# Altium schematic sheet Cyusb3314_Indicator.SchDoc
size 391 x 287 mm
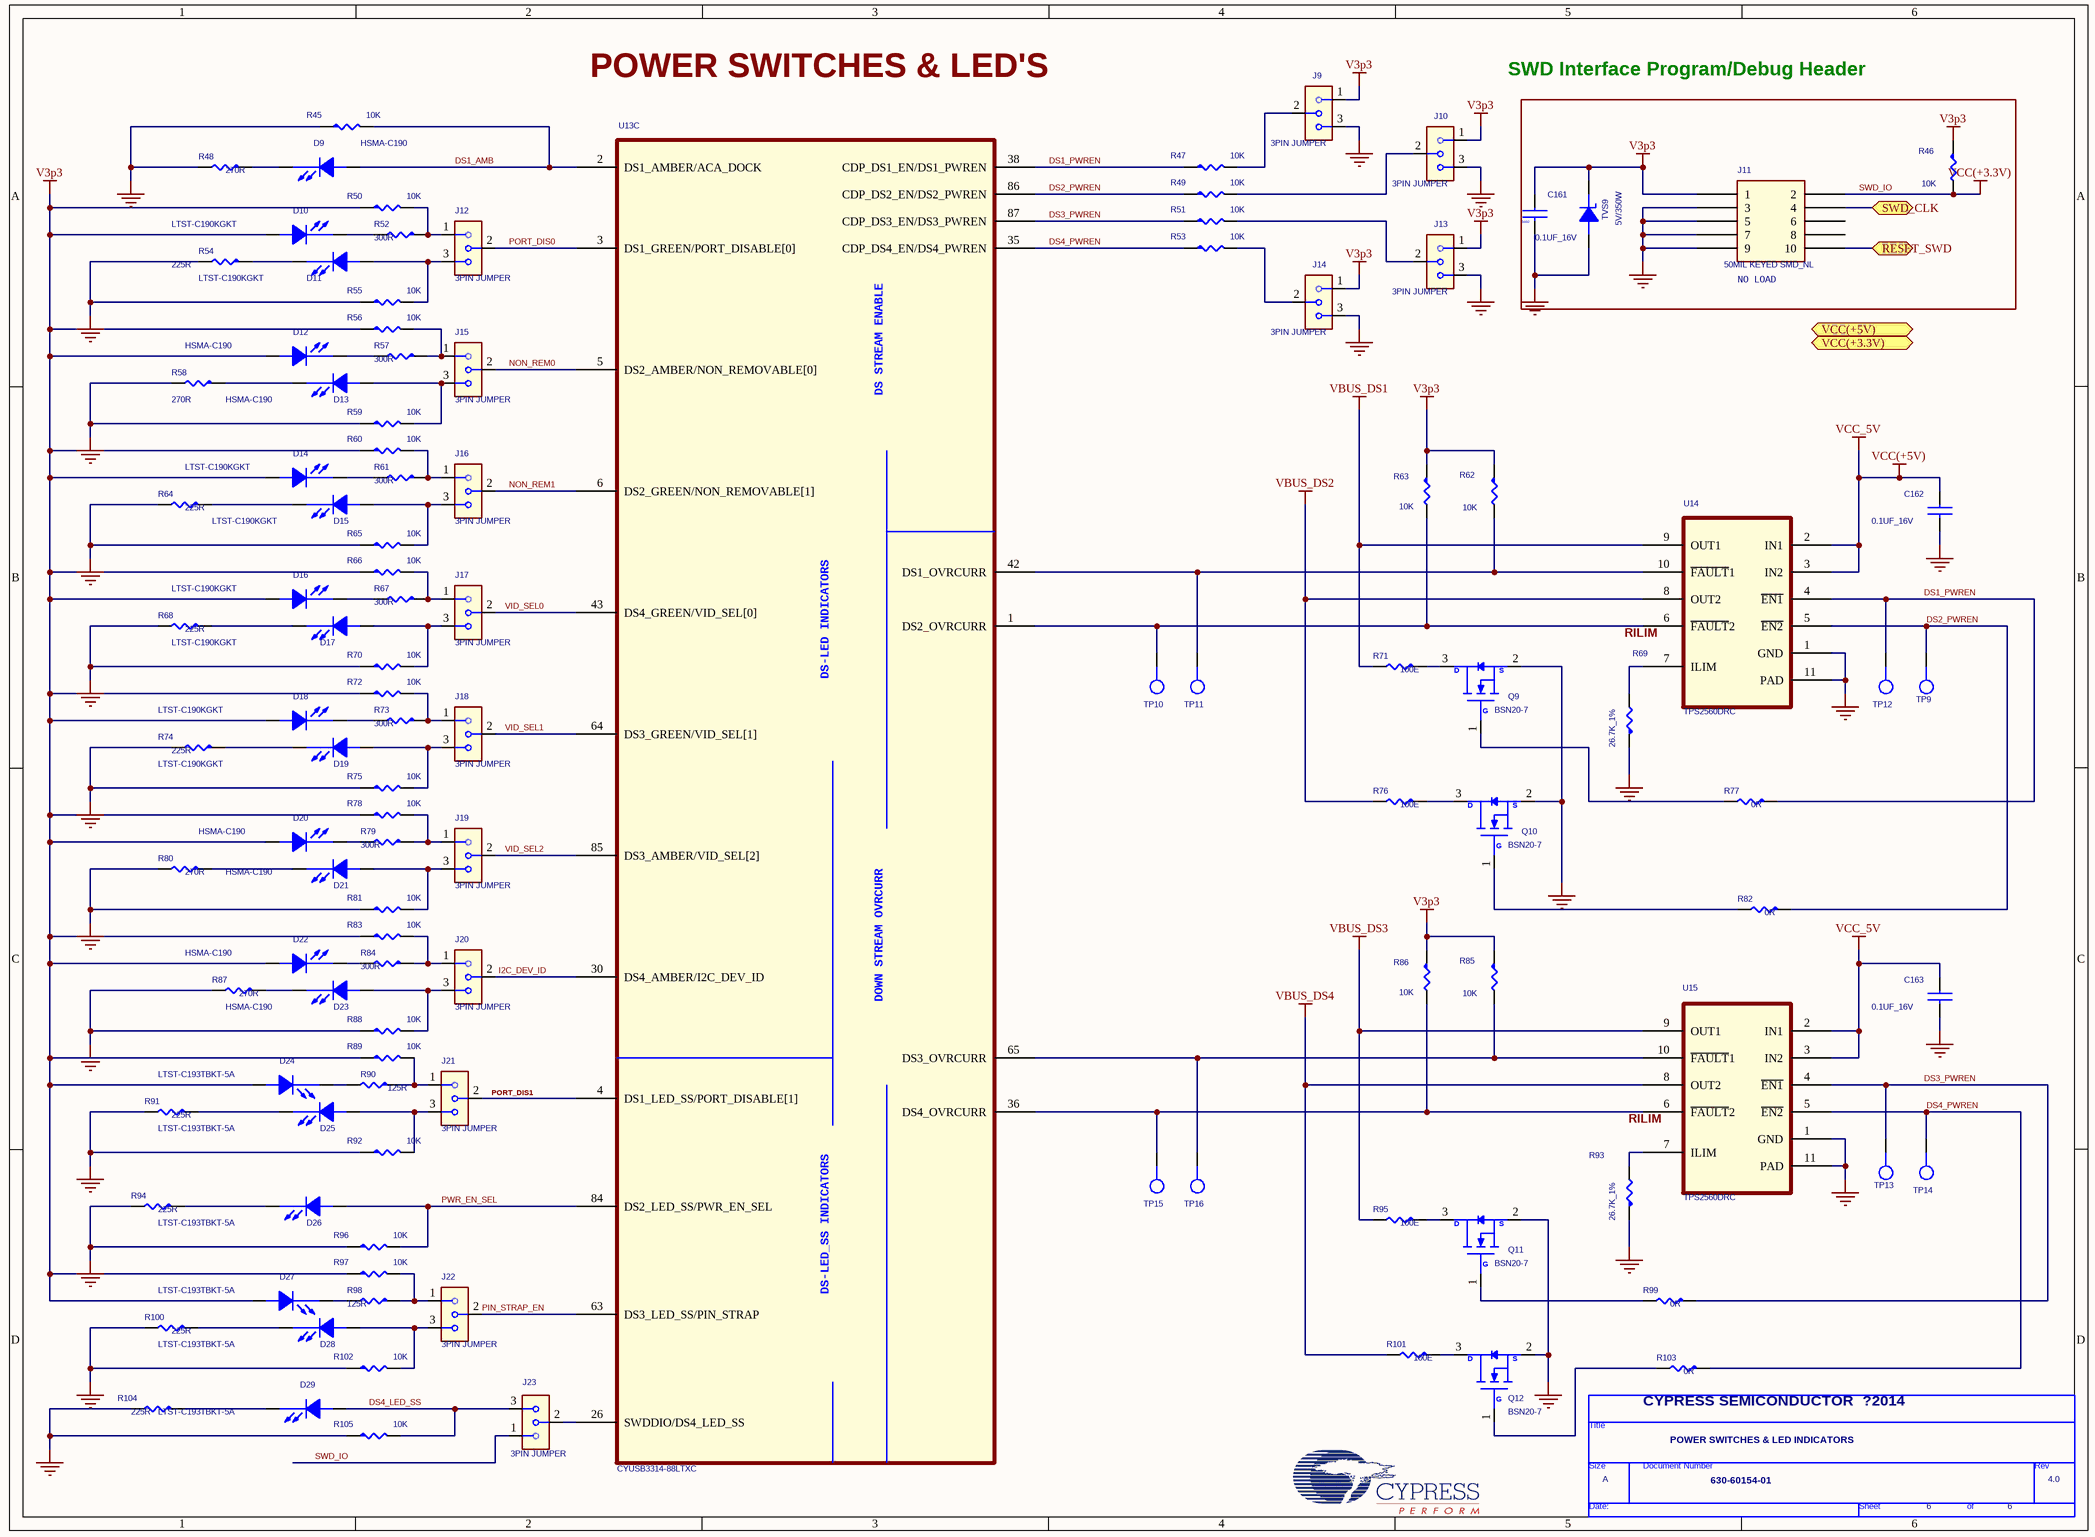
[diagram p0: Cyusb3314_Indicator.SchDoc]

## Parts
*  Page Count: 6  Page Size: A  Title: POWER SWITCHES & LED INDICATORS  RevCode: 4.0  Doc: 630-60154-01  (hidden comment: TitleBlock0)  (graphical)
C161  0.1UF_16V  [CAPC1005X55M]
C162  0.1UF_16V  [CAPC1005X56M]
C163  0.1UF_16V  [CAPC1005X56M]
D9  HSMA-C190  [LEDC1608X80M]
D10  LTST-C190KGKT  [LEDC1608X80M]
D11  LTST-C190KGKT  [LEDC1608X80M]
D12  HSMA-C190  [LEDC1608X80M]
D13  HSMA-C190  [LEDC1608X80M]
D14  LTST-C190KGKT  [LEDC1608X80M]
D15  LTST-C190KGKT  [LEDC1608X80M]
D16  LTST-C190KGKT  [LEDC1608X80M]
D17  LTST-C190KGKT  [LEDC1608X80M]
D18  LTST-C190KGKT  [LEDC1608X80M]
D19  LTST-C190KGKT  [LEDC1608X80M]
D20  HSMA-C190  [LEDC1608X80M]
D21  HSMA-C190  [LEDC1608X80M]
D22  HSMA-C190  [LEDC1608X80M]
D23  HSMA-C190  [LEDC1608X80M]
D24  LTST-C193TBKT-5A  [LEDC1608X35M]
D25  LTST-C193TBKT-5A  [LEDC1608X35M]
D26  LTST-C193TBKT-5A  [LEDC1608X35M]
D27  LTST-C193TBKT-5A  [LEDC1608X35M]
D28  LTST-C193TBKT-5A  [LEDC1608X35M]
D29  LTST-C193TBKT-5A  [LEDC1608X35M]
J9  3PIN JUMPER  [TE_3-644456-3]
J10  3PIN JUMPER  [TE_3-644456-3]
J11  50MIL KEYED SMD_NL  [SAMTEC_FTSH-105-01-L-DV-K]
J12  3PIN JUMPER  [TE_3-644456-3]
J13  3PIN JUMPER  [TE_3-644456-3]
J14  3PIN JUMPER  [TE_3-644456-3]
J15  3PIN JUMPER  [TE_3-644456-3]
J16  3PIN JUMPER  [TE_3-644456-3]
J17  3PIN JUMPER  [TE_3-644456-3]
J18  3PIN JUMPER  [TE_3-644456-3]
J19  3PIN JUMPER  [TE_3-644456-3]
J20  3PIN JUMPER  [TE_3-644456-3]
J21  3PIN JUMPER  [TE_3-644456-3]
J22  3PIN JUMPER  [TE_3-644456-3]
J23  3PIN JUMPER  [TE_3-644456-3]
Q9  BSN20-7  [SOT92P240X110-3M]
Q10  BSN20-7  [SOT92P240X110-3M]
Q11  BSN20-7  [SOT92P240X110-3M]
Q12  BSN20-7  [SOT92P240X110-3M]
R45  10K  [RESC1005X40M]
R46  10K  [RESC1005X40M]
R47  10K  [RESC1005X40M]
R48  270R  [RESC1608X50M]
R49  10K  [RESC1005X40M]
R50  10K  [RESC1005X40M]
R51  10K  [RESC1005X40M]
R52  300R  [RESC2012X65M]
R53  10K  [RESC1005X40M]
R54  225R  [RESC1608X50M]
R55  10K  [RESC1005X40M]
R56  10K  [RESC1005X40M]
R57  300R  [RESC2012X65M]
R58  270R  [RESC1608X50M]
R59  10K  [RESC1005X40M]
R60  10K  [RESC1005X40M]
R61  300R  [RESC2012X65M]
R62  10K  [RESC1005X40M]
R63  10K  [RESC1005X40M]
R64  225R  [RESC1608X50M]
R65  10K  [RESC1005X40M]
R66  10K  [RESC1005X40M]
R67  300R  [RESC2012X65M]
R68  225R  [RESC1608X50M]
R69  26.7K_1%  [RESC1005X40M]
R70  10K  [RESC1005X40M]
R71  100E  [RESC1608X50M]
R72  10K  [RESC1005X40M]
R73  300R  [RESC2012X65M]
R74  225R  [RESC1608X50M]
R75  10K  [RESC1005X40M]
R76  100E  [RESC1608X50M]
R77  0R  [RESC1608X50M]
R78  10K  [RESC1005X40M]
R79  300R  [RESC2012X65M]
R80  270R  [RESC1608X50M]
R81  10K  [RESC1005X40M]
R82  0R  [RESC1608X50M]
R83  10K  [RESC1005X40M]
R84  300R  [RESC2012X65M]
R85  10K  [RESC1005X40M]
R86  10K  [RESC1005X40M]
R87  270R  [RESC1608X50M]
R88  10K  [RESC1005X40M]
R89  10K  [RESC1005X40M]
R90  125R  [RESC2012X65M]
R91  225R  [RESC1608X50M]
R92  10K  [RESC1005X40M]
R93  26.7K_1%  [RESC1005X40M]
R94  225R  [RESC1608X50M]
R95  100E  [RESC1608X50M]
R96  10K  [RESC1005X40M]
R97  10K  [RESC1005X40M]
R98  125R  [RESC2012X65M]
R99  0R  [RESC1608X50M]
R100  225R  [RESC1608X50M]
R101  100E  [RESC1608X50M]
R102  10K  [RESC1005X40M]
R103  0R  [RESC1608X50M]
R104  225R  [RESC1608X50M]
R105  10K  [RESC1005X40M]
TP9  TP_YEL  [KEYSTONE_5000]  (value not drawn)
TP10  TEST POINT  [TP25C50]  (value not drawn)
TP11  TP_YEL  [KEYSTONE_5000]  (value not drawn)
TP12  TEST POINT  [TP25C50]  (value not drawn)
TP13  TP_YEL  [KEYSTONE_5000]  (value not drawn)
TP14  TEST POINT  [TP25C50]  (value not drawn)
TP15  TEST POINT  [TP25C50]  (value not drawn)
TP16  TP_YEL  [KEYSTONE_5000]  (value not drawn)
TVS9  5V/350W  [SOD2513X120M]
U13  CYUSB3314-88LTXC  [QFN40P1000X1000X100-89M]  (part C of 3)
U14  TPS2560DRC  [SON50P300X300X100-11M]
U15  TPS2560DRC  [SON50P300X300X100-11M]

## Blocks framed on the sheet
NO LOAD: C161 J11 R46 TVS9

## Ports
RESET_SWD (bidir), SWD_CLK (bidir), VCC(+3.3V) (in), VCC(+5V) (in)

## Nets
GND: C161.2 C162.2 C163.2 J9.3 J10.3 J11.3 J11.5 J11.7 J11.9 J13.3 J14.3 Q9.2(S) Q10.2(S) Q11.2(S) Q12.2(S) R45.1 R48.2 R54.2 R55.1 R58.2 R59.1 R64.2 R65.1 R68.2 R69.1 R70.1 R74.2 R75.1 R80.2 R81.1 R87.2 R88.1 R91.2 R92.1 R93.1 R94.2 R96.1 R100.2 R102.1 R104.2 R105.1 TVS9.2(A) U14.1(GND) U14.11(PAD) U15.1(GND) U15.11(PAD)
SWD_IO: J11.2 J23.1 R46.2  [also labelled VCC(+3.3V)]
V3p3: C161.1 D10.1(ANODE) D12.1(ANODE) D14.1(ANODE) D16.1(ANODE) D18.1(ANODE) D20.1(ANODE) D22.1(ANODE) D24.1(ANODE) D27.1(ANODE) J9.1 J10.1 J11.1 J13.1 J14.1 R46.1 R50.1 R56.1 R60.1 R62.1 R63.1 R66.1 R72.1 R78.1 R83.1 R85.1 R86.1 R89.1 R97.1 TVS9.1(K)
VBUS_DS1: R71.2 U14.9(OUT1)
VBUS_DS2: R76.2 U14.8(OUT2)
VBUS_DS3: R95.2 U15.9(OUT1)
VBUS_DS4: R101.2 U15.8(OUT2)
VCC(+5V): C162.1 C163.1 U14.2(IN1) U14.3(IN2) U15.2(IN1) U15.3(IN2)  [also labelled VCC_5V]
DS1_AMB: D9.1(ANODE) R45.2 U13.2(DS1_AMBER/ACA_DOCK)
DS1_PWREN: R47.1 R77.1 TP12.1(TP) U13.38(CDP_DS1_EN/DS1_PWREN) U14.4(~{EN1})
DS2_PWREN: R49.1 R82.1 TP9.1(TP) U13.86(CDP_DS2_EN/DS2_PWREN) U14.5(~{EN2})
DS3_PWREN: R51.1 R99.1 TP13.1(TP) U13.87(CDP_DS3_EN/DS3_PWREN) U15.4(~{EN1})
DS4_LED_SS: D29.1(ANODE) J23.3 R105.2
DS4_PWREN: R53.1 R103.1 TP14.1(TP) U13.35(CDP_DS4_EN/DS4_PWREN) U15.5(~{EN2})
I2C_DEV_ID: J20.2 U13.30(DS4_AMBER/I2C_DEV_ID)
NON_REM0: J15.2 U13.5(DS2_AMBER/NON_REMOVABLE[0])
NON_REM1: J16.2 U13.6(DS2_GREEN/NON_REMOVABLE[1])
PIN_STRAP_EN: J22.2 U13.63(DS3_LED_SS/PIN_STRAP)
PORT_DIS0: J12.2 U13.3(DS1_GREEN/PORT_DISABLE[0])
PORT_DIS1: J21.2 U13.4(DS1_LED_SS/PORT_DISABLE[1])
PWR_EN_SEL: D26.1(ANODE) R96.2 U13.84(DS2_LED_SS/PWR_EN_SEL)
RESET_SWD: J11.10 ; port RESET_SWD
SWD_CLK: J11.4 ; port SWD_CLK
VID_SEL0: J17.2 U13.43(DS4_GREEN/VID_SEL[0])
VID_SEL1: J18.2 U13.64(DS3_GREEN/VID_SEL[1])
VID_SEL2: J19.2 U13.85(DS3_AMBER/VID_SEL[2])
NetD9_2: D9.2(CATHODE) R48.1
NetD10_2: D10.2(CATHODE) R52.2
NetD11_1: D11.1(ANODE) J12.3 R55.2
NetD11_2: D11.2(CATHODE) R54.1
NetD12_2: D12.2(CATHODE) R57.2
NetD13_1: D13.1(ANODE) J15.3 R59.2
NetD13_2: D13.2(CATHODE) R58.1
NetD14_2: D14.2(CATHODE) R61.2
NetD15_1: D15.1(ANODE) J16.3 R65.2
NetD15_2: D15.2(CATHODE) R64.1
NetD16_2: D16.2(CATHODE) R67.2
NetD17_1: D17.1(ANODE) J17.3 R70.2
NetD17_2: D17.2(CATHODE) R68.1
NetD18_2: D18.2(CATHODE) R73.2
NetD19_1: D19.1(ANODE) J18.3 R75.2
NetD19_2: D19.2(CATHODE) R74.1
NetD20_2: D20.2(CATHODE) R79.2
NetD21_1: D21.1(ANODE) J19.3 R81.2
NetD21_2: D21.2(CATHODE) R80.1
NetD22_2: D22.2(CATHODE) R84.2
NetD23_1: D23.1(ANODE) J20.3 R88.2
NetD23_2: D23.2(CATHODE) R87.1
NetD24_2: D24.2(CATHODE) R90.2
NetD25_1: D25.1(ANODE) J21.3 R92.2
NetD25_2: D25.2(CATHODE) R91.1
NetD26_2: D26.2(CATHODE) R94.1
NetD27_2: D27.2(CATHODE) R98.2
NetD28_1: D28.1(ANODE) J22.3 R102.2
NetD28_2: D28.2(CATHODE) R100.1
NetD29_2: D29.2(CATHODE) R104.1
NetJ9_2: J9.2 R47.2
NetJ10_2: J10.2 R49.2
NetJ12_1: J12.1 R50.2 R52.1
NetJ13_2: J13.2 R51.2
NetJ14_2: J14.2 R53.2
NetJ15_1: J15.1 R56.2 R57.1
NetJ16_1: J16.1 R60.2 R61.1
NetJ17_1: J17.1 R66.2 R67.1
NetJ18_1: J18.1 R72.2 R73.1
NetJ19_1: J19.1 R78.2 R79.1
NetJ20_1: J20.1 R83.2 R84.1
NetJ21_1: J21.1 R89.2 R90.1
NetJ22_1: J22.1 R97.2 R98.1
NetJ23_2: J23.2 U13.26(SWDDIO/DS4_LED_SS)
NetQ9_1: Q9.1(G) R77.2
NetQ9_3: Q9.3(D) R71.1
NetQ10_1: Q10.1(G) R82.2
NetQ10_3: Q10.3(D) R76.1
NetQ11_1: Q11.1(G) R99.2
NetQ11_3: Q11.3(D) R95.1
NetQ12_1: Q12.1(G) R103.2
NetQ12_3: Q12.3(D) R101.1
NetR62_2: R62.2 TP11.1(TP) U13.42(DS1_OVRCURR) U14.10(~{FAULT}1)
NetR63_2: R63.2 TP10.1(TP) U13.1(DS2_OVRCURR) U14.6(~{FAULT}2)
NetR69_2: R69.2 U14.7(ILIM)
NetR85_2: R85.2 TP16.1(TP) U13.65(DS3_OVRCURR) U15.10(~{FAULT}1)
NetR86_2: R86.2 TP15.1(TP) U13.36(DS4_OVRCURR) U15.6(~{FAULT}2)
NetR93_2: R93.2 U15.7(ILIM)

Not connected (* = marked no-connect by the designer): J11 6 8

## Notes on the sheet
- POWER SWITCHES & LED'S
- SWD Interface Program/Debug Header
- (near U14) RILIM
- (near U15) RILIM
- (near R103) CYPRESS SEMICONDUCTOR  ?2014
- (in symbol 0.1 uFd 0402) 0402
- (in symbol CYUSB3314-88LTXC_2, part C) DS STREAM ENABLE; DS-LED INDICATORS; DOWN STREAM OVRCURR; DS-LED_SS INDICATORS
- (in symbol TitleBlock0) Title; Size; Document Number; Rev; Date:; Sheet; of

## Library data of the parts
C161 = 0.1 uFd 0402: CAP .1UF 16V CERAMIC Y5V 0402; Cy_part#: 730R-10010; Manufacturer: Panasonic - ECG; Part Number: ECJ-0EF1C104Z; DEVICE: 0p1uFd_0402; CLASS: DISCRETE; ALT_SYMBOLS: C-CC0402_A; VOLTAGE: 16V; Created by: SNF
C162 C163 = CAPACITOR NON-POL: Manufacturer: *; Part Number: *
D9-D29 = LED: Manufacturer: *
  D9 D12 D13 D20-D23: Part Number: HSMA-C190
  D10 D11 D14-D19: Part Number: LTST-C190KGKT
  D24-D29: Part Number: LTST-C193TBKT-5A
J9 J12 J13 J15 J16 J18 J21-J23 = 3PIN JUM: CONN HEADER VERT 3POS .100 TIN; Part Number: 3-644456-3; Manufacturer: Tyco Electronics; Type: Single Row,3Pin Header
J10 J14 J17 J19 J20 = 3PIN JUM: CONN HEADER VERT 3POS .100 TIN; Manufacturer: Tyco Electronics; Part Number: 3-644456-3; Type: Single Row,3Pin Header
J11 = 10 Pin Header 50mil Keyed SMD: CONN HEADER 10 PIN 50MIL KEYED SMD; Part Number: FTSH-105-01-L-DV-K; Manufacturer: Samtec; Cy_part#: 420R-14312; CLASS: IO; Last Edit By: SNF; DEVICE: HDR5x2x50KS
Q9-Q12 = BSN20-7: MOSFET N-CH 50V 500MA SOT23; Manufacturer: Diodes Inc; PSpiceTemplate: X^@REFDES %D %G %S @MODEL; Part Number: BSN20-7
R45-R47 R49-R51 R53 R55 R60 R62 R65 R70 R72 R75 R78 R81 R86 R88 R89 R96 R97 R102 R105 = R_Dup1: RES 10.0K OHM 1/10W 1% 0603 SMD; Manufacturer: Panasonic - ECG; Part Number: ERJ-3EKF1002V; Lead Free: YES
R48 R52 R54 R57 R58 R61 R64 R67 R68 R71 R73 R74 R76 R77 R79 R80 R82 R84 R87 R90 R91 R94 R95 R98-R101 R103 R104 = R_Dup1: Lead Free: YES
  R48 R58: Value: 270R
  R54: Value: 225R
R56 R59 R63 R66 R83 R85 R92 = R_Dup1: RES 10.0K OHM 1/10W 1% 0603 SMD; Part Number: ERJ-3EKF1002V; Manufacturer: Panasonic - ECG; Lead Free: YES
R69 = R_Dup1: RES 28.0K OHM 1/10W 1% 0402 SMD; Manufacturer: Panasonic; Part Number: ERJ-2RKF2802X; Manufacturer Part Num: R5110402; Tolerance: 1%
R93 = R_Dup1: RES 28.0K OHM 1/10W 1% 0402 SMD; Part Number: ERJ-2RKF2802X; Manufacturer Part Num: R5110402; Manufacturer: Panasonic; Tolerance: 1%
TP9 TP13 = TP: TEST POINT PC MINI .040"D RED; Manufacturer: Keystone; Part Number: 5000
TP10 TP12 TP14 TP15 = TP
TP11 TP16 = TP: TEST POINT PC MINI .040"D RED; Part Number: 5000; Manufacturer: Keystone
TVS9 = TVS 5V SOD-323_0: TVS UNIDIR 350W 5V SOD-323; Part Number: SD05.TCT; Manufacturer: Dioded Inc.; CLASS: DISCRETE; DEVICE: SD05-7; LastEditBy: gir
U13 = CYUSB3314-88LTXC_2: Manufacturer: *; Part Number: CYUSB3314-88LTXC
* = TitleBlock0: Page Number: 6; Page Create Date: March  8, 1995
U14 U15 = TPS2560DRC: Part Number: TPS2560DRC; Manufacturer: *